# Altium schematic sheet Э1.SchDoc: =title_line_1 + title_line_2
size 420 x 297 mm; ApprovedBy: Мерзлякова; CheckedBy: Площадная; DrawnBy: Площадная; DocumentNumber: Э1; SheetNumber: 1; SheetTotal: 2; check: Андриенко; title_line_1: плата; title_line_2: ЕТЗ; document_type: схема электрическая структурная
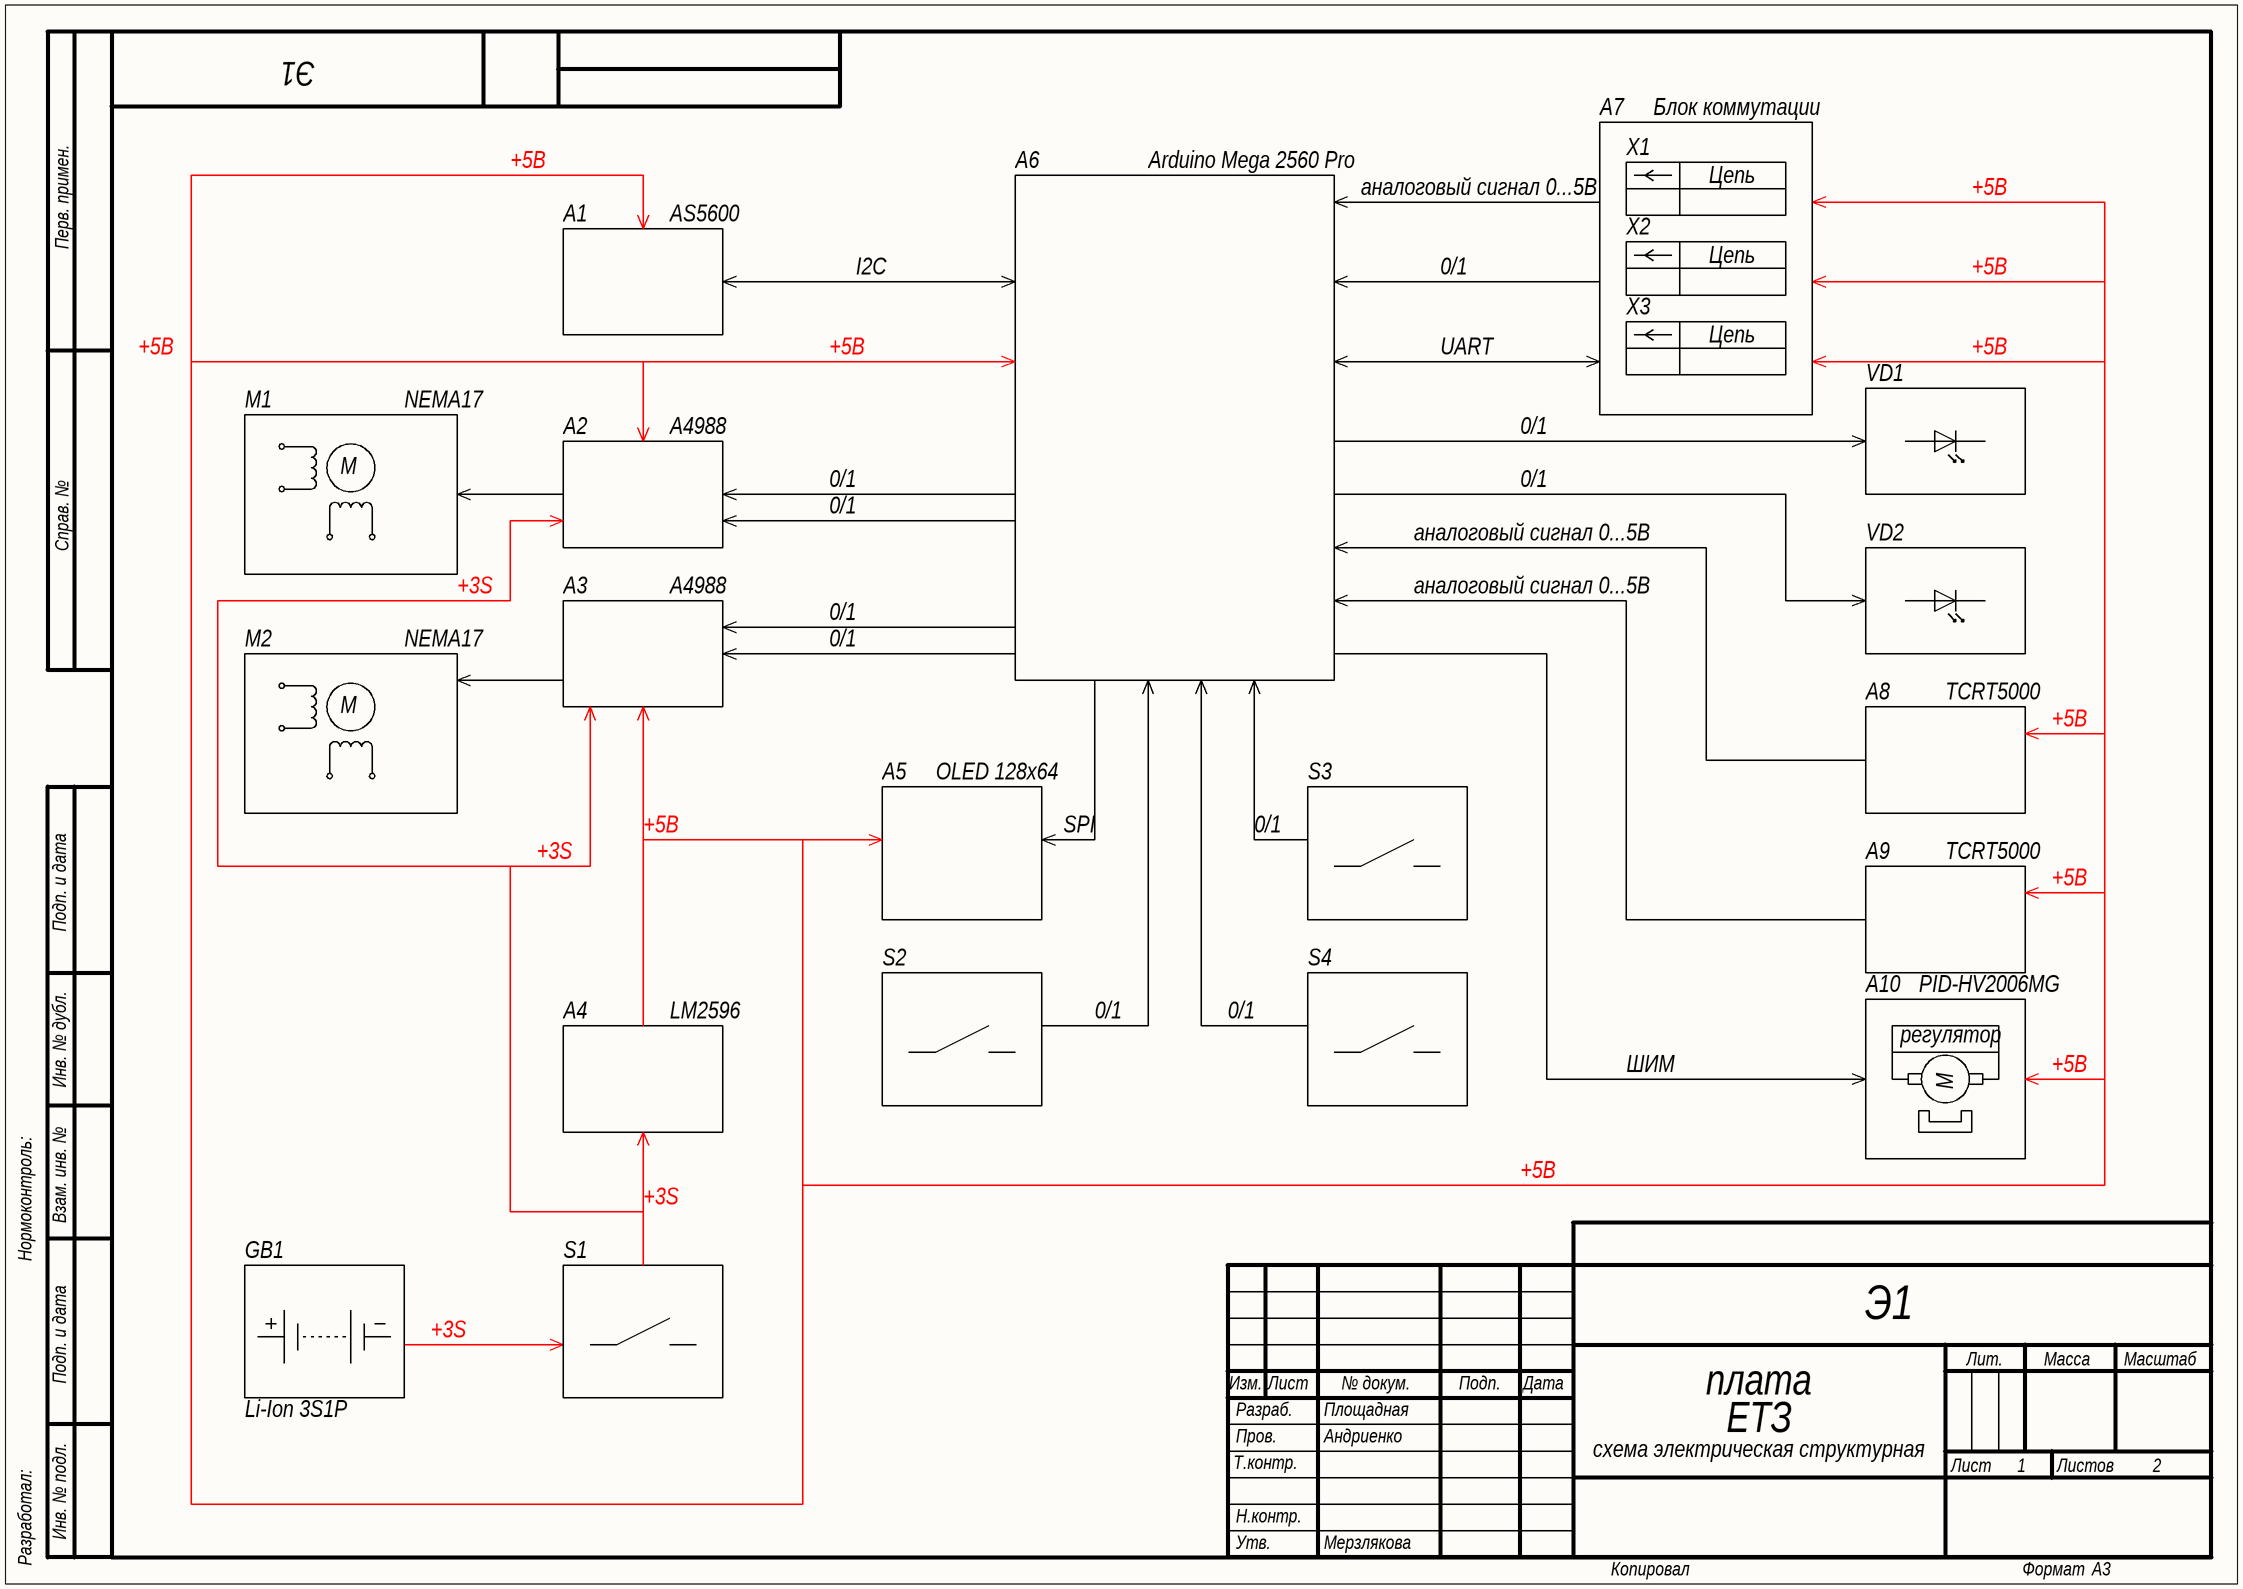
[diagram p0: Э1.SchDoc]

## Parts
M3  мотор  [terminal-block]  (value not drawn)
X1  для датчиков  [PLS-2.54-3]  (value not drawn)
X2  для датчиков  [PLS-2.54-3]  (value not drawn)
X3  для датчиков  [PLS-2.54-3]  (value not drawn)

## Nets

Not connected (* = marked no-connect by the designer): M3 1 2

## Notes on the sheet
- A7
- Блок коммутации
- +5В
- A6
- Arduino Mega 2560 Pro
- A1
- AS5600
- аналоговый сигнал 0...5В
- I2C
- 0/1
- UART
- VD1
- M1
- NEMA17
- A2
- A4988
- М
- +3S
- A3
- VD2
- M2
- A8
- TCRT5000
- A5
- OLED 128х64
- S3
- SPI
- A9
- S2
- S4
- A10
- PID-HV2006MG
- A4
- LM2596
- (near M3) регулятор
- ШИМ
- GB1
- S1
- Li-Ion 3S1P
- Перв. примен.
- Справ. №
- Подп. и дата
- Инв. № дубл.
- Нормоконтроль:
- Взам. инв. №
- Изм.
- Лист
- № докум.
- Подп.
- Дата
- Лит.
- Масса
- Масштаб
- Т.контр.
- Пров.
- Разраб.
- Листов
- Разработал:
- Инв. № подл.
- Н.контр.
- Утв.
- Копировал
- Формат
- А3
- (in symbol MOTOR) M
- (in symbol PLS-2.54-3_1) Цепь

## Library data of the parts
M3 = MOTOR: nam: мотор
X1-X3 = PLS-2.54-3_1: nam: для датчиков; Contact_1: *; Contact_2: *; Contact_3: *